# Altium schematic sheet 22 MXM_VIDEO_OUT.SchDoc
size 420 x 297 mm
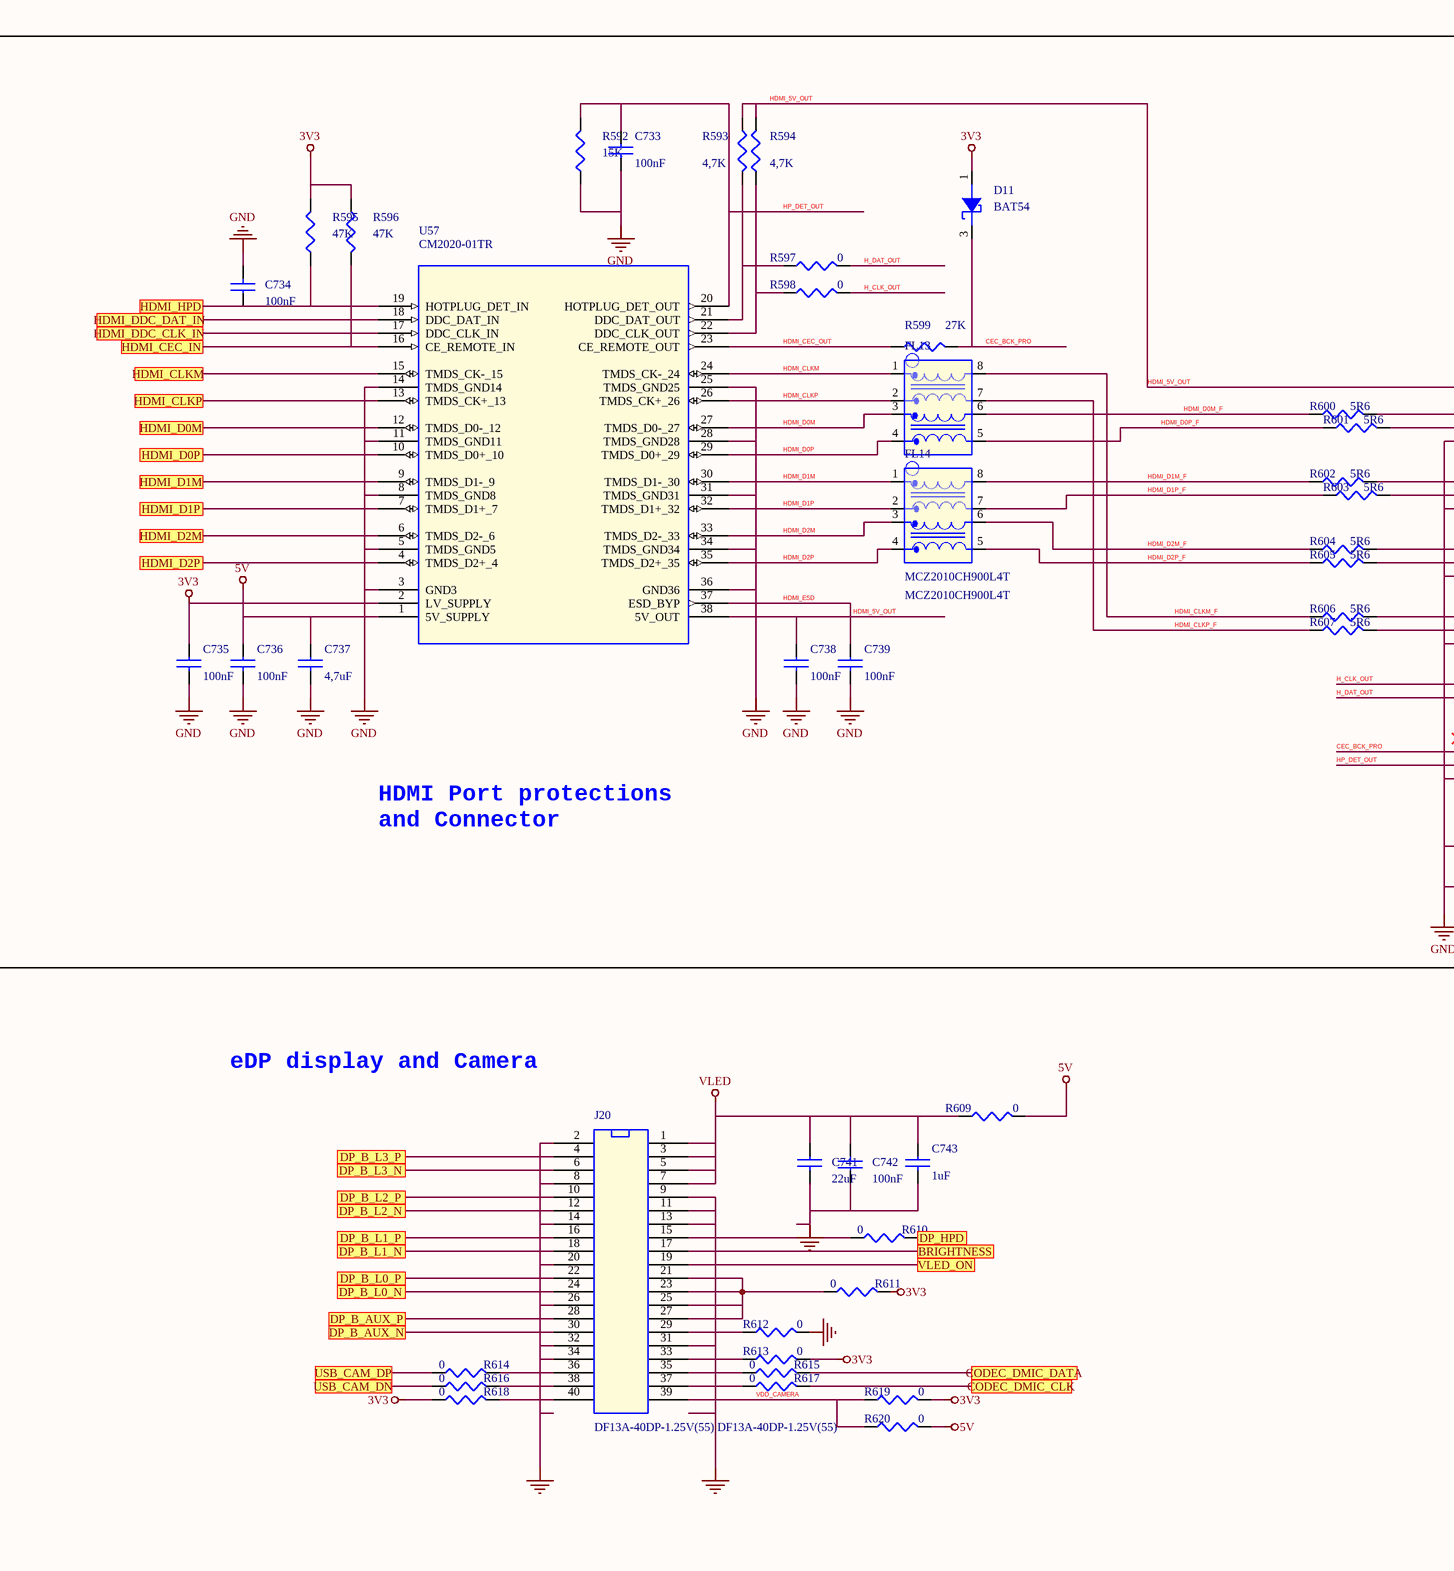
[diagram p0: 22 MXM_VIDEO_OUT.SchDoc, left]
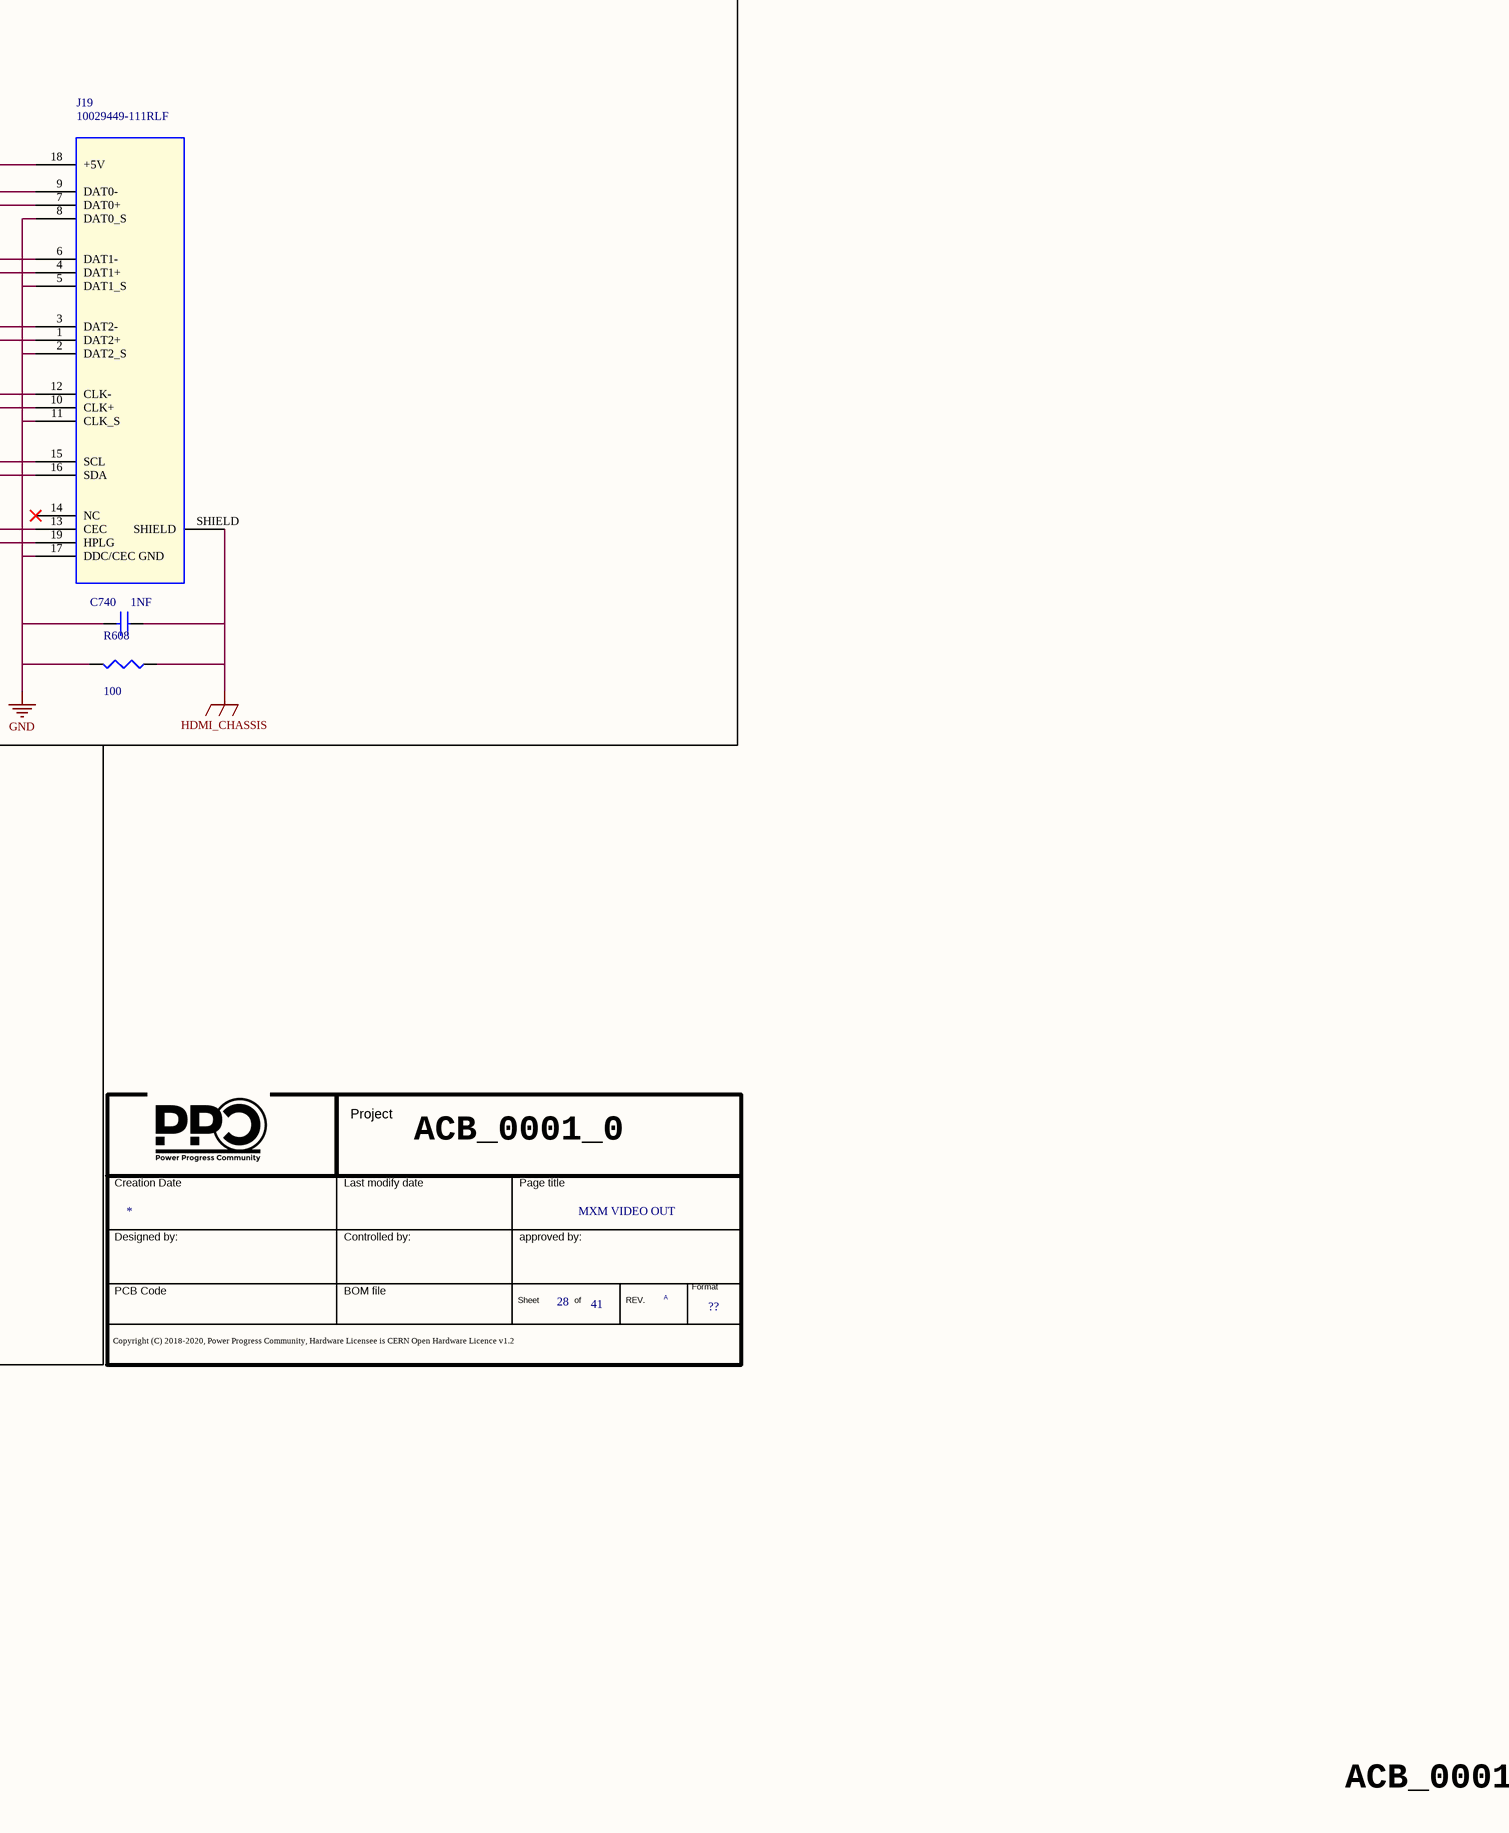
[diagram p1: 22 MXM_VIDEO_OUT.SchDoc, right]

## Parts
*  Doc: MXM VIDEO OUT  Page Count: 41  Page Number: 28  Page Size: ??  RevCode: A  (hidden comment: Title_block_PPC)  (graphical)
C733  100nF  [SMD_0402]
C734  100nF  [SMD_0402]
C735  100nF  [SMD_0402]
C736  100nF  [SMD_0402]
C737  4,7uF  [SMD_0603]
C738  100nF  [SMD_0402]
C739  100nF  [SMD_0402]
C740  1NF  [SMD_1808]
C741  22uF  [SMD_0805]
C742  100nF  [SMD_0402]
C743  1uF  [SMD_0402]
D11  BAT54  [SOT-23]
FL13  MCZ2010CH900L4T  [SMD]
FL14  MCZ2010CH900L4T  [SMD]
J19  10029449-111RLF  [19 PIN SMD]
J20  DF13A-40DP-1.25V(55) / DF13A-40DP-1.25V(55)  [SMD_2X50_P=0.635mm]
R592  15K  [SMD_0402]
R593  4,7K  [SMD_0402]
R594  4,7K  [SMD_0402]
R595  47K  [SMD_0402]
R596  47K  [SMD_0402]
R597  0  [SMD_0402]
R598  0  [SMD_0402]
R599  27K  [SMD_0402]
R600  5R6  [SMD_0402]
R601  5R6  [SMD_0402]
R602  5R6  [SMD_0402]
R603  5R6  [SMD_0402]
R604  5R6  [SMD_0402]
R605  5R6  [SMD_0402]
R606  5R6  [SMD_0402]
R607  5R6  [SMD_0402]
R608  100  [SMD_0402]
R609  0  [SMD_1206]
R610  0  [SMD_0402]
R611  0  [SMD_0402]
R612  0  [SMD_0402]
R613  0  [SMD_0402]
R614  0  [SMD_0402]
R615  0  [SMD_0402]
R616  0  [SMD_0402]
R617  0  [SMD_0402]
R618  0  [SMD_0402]
R619  0  [SMD_0402]
R620  0  [SMD_0402]
U57  CM2020-01TR  [tssop38]

## Blocks framed on the sheet
eDP display and Camera: C741-C743 J20 R609-R620

## Ports
BRIGHTNESS, CODEC_DMIC_CLK, CODEC_DMIC_DATA, DP_B_AUX_N, DP_B_AUX_P, DP_B_L0_N, DP_B_L0_P, DP_B_L1_N, DP_B_L1_P, DP_B_L2_N, DP_B_L2_P, DP_B_L3_N, DP_B_L3_P, DP_HPD, HDMI_CEC_IN, HDMI_CLKM, HDMI_CLKP, HDMI_D0M, HDMI_D0P, HDMI_D1M, HDMI_D1P, HDMI_D2M, HDMI_D2P, HDMI_DDC_CLK_IN, HDMI_DDC_DAT_IN, HDMI_HPD, USB_CAM_DN, USB_CAM_DP, VLED_ON

## Nets
3V3: C735.1 D11.1(ANODE) R595.1 R596.1 R611.1 R613.2 R618.2 R619.2 U57.2(LV_SUPPLY)
5V: C736.1 C737.1 R609.2 R620.2 U57.1(5V_SUPPLY)
GND: C733.2 C734.2 C735.2 C736.2 C737.2 C738.2 C739.2 C740.2 C741.2 C742.1 C743.2 J19.2(DAT2_S) J19.5(DAT1_S) J19.8(DAT0_S) J19.11(CLK_S) J19.17(DDC/CEC_GND) J20.2 J20.8 J20.9 J20.11 J20.13 J20.14 J20.20 J20.26 J20.31 J20.32 J20.34 R592.2 R608.2 R612.2 U57.3(GND3) U57.5(TMDS_GND5) U57.8(TMDS_GND8) U57.11(TMDS_GND11) U57.14(TMDS_GND14) U57.25(TMDS_GND25) U57.28(TMDS_GND28) U57.31(TMDS_GND31) U57.34(TMDS_GND34) U57.36(GND36)
HDMI_CHASSIS: C740.1 J19.SHIELD R608.1
VLED: C741.1 C742.2 C743.1 J20.1 J20.3 J20.5 J20.7 R609.1
BRIGHTNESS: J20.17 ; port BRIGHTNESS
CEC_BCK_PRO: D11.3(CATHODE) J19.13(CEC) R599.2
CODEC_DMIC_CLK: R617.1 ; port CODEC_DMIC_CLK
CODEC_DMIC_DATA: R615.1 ; port CODEC_DMIC_DATA
DP_B_AUX_N: J20.30 ; port DP_B_AUX_N
DP_B_AUX_P: J20.28 ; port DP_B_AUX_P
DP_B_L0_N: J20.24 ; port DP_B_L0_N
DP_B_L0_P: J20.22 ; port DP_B_L0_P
DP_B_L1_N: J20.18 ; port DP_B_L1_N
DP_B_L1_P: J20.16 ; port DP_B_L1_P
DP_B_L2_N: J20.12 ; port DP_B_L2_N
DP_B_L2_P: J20.10 ; port DP_B_L2_P
DP_B_L3_N: J20.6 ; port DP_B_L3_N
DP_B_L3_P: J20.4 ; port DP_B_L3_P
DP_HPD: R610.1 ; port DP_HPD
H_CLK_OUT: J19.15(SCL) R598.2
H_DAT_OUT: J19.16(SDA) R597.2
HDMI_5V_OUT: C738.1 J19.18(+5V) R593.2 R594.2 U57.38(5V_OUT)
HDMI_CEC_IN: R596.2 U57.16(CE_REMOTE_IN) ; port HDMI_CEC_IN
HDMI_CEC_OUT: R599.1 U57.23(CE_REMOTE_OUT)
HDMI_CLKM: FL13.1 U57.24(TMDS_CK-_24)
HDMI_CLKM: U57.15(TMDS_CK-_15) ; port HDMI_CLKM  [a separate net that carries the same name]
HDMI_CLKM_F: FL13.8 R606.1
HDMI_CLKP: FL13.2 U57.26(TMDS_CK+_26)
HDMI_CLKP: U57.13(TMDS_CK+_13) ; port HDMI_CLKP  [a separate net that carries the same name]
HDMI_CLKP_F: FL13.7 R607.1
HDMI_D0M: FL13.3 U57.27(TMDS_D0-_27)
HDMI_D0M: U57.12(TMDS_D0-_12) ; port HDMI_D0M  [a separate net that carries the same name]
HDMI_D0M_F: FL13.6 R600.1
HDMI_D0P: FL13.4 U57.29(TMDS_D0+_29)
HDMI_D0P: U57.10(TMDS_D0+_10) ; port HDMI_D0P  [a separate net that carries the same name]
HDMI_D0P_F: FL13.5 R601.1
HDMI_D1M: FL14.1 U57.30(TMDS_D1-_30)
HDMI_D1M: U57.9(TMDS_D1-_9) ; port HDMI_D1M  [a separate net that carries the same name]
HDMI_D1M_F: FL14.8 R602.1
HDMI_D1P: FL14.2 U57.32(TMDS_D1+_32)
HDMI_D1P: U57.7(TMDS_D1+_7) ; port HDMI_D1P  [a separate net that carries the same name]
HDMI_D1P_F: FL14.7 R603.1
HDMI_D2M: FL14.3 U57.33(TMDS_D2-_33)
HDMI_D2M: U57.6(TMDS_D2-_6) ; port HDMI_D2M  [a separate net that carries the same name]
HDMI_D2M_F: FL14.6 R604.1
HDMI_D2P: FL14.4 U57.35(TMDS_D2+_35)
HDMI_D2P: U57.4(TMDS_D2+_4) ; port HDMI_D2P  [a separate net that carries the same name]
HDMI_D2P_F: FL14.5 R605.1
HDMI_DDC_CLK_IN: U57.17(DDC_CLK_IN) ; port HDMI_DDC_CLK_IN
HDMI_DDC_DAT_IN: U57.18(DDC_DAT_IN) ; port HDMI_DDC_DAT_IN
HDMI_ESD: C739.1 U57.37(ESD_BYP)
HDMI_HPD: C734.1 R595.2 U57.19(HOTPLUG_DET_IN) ; port HDMI_HPD
HP_DET_OUT: C733.1 J19.19(HPLG) R592.1 U57.20(HOTPLUG_DET_OUT)
USB_CAM_DN: R616.2 ; port USB_CAM_DN
USB_CAM_DP: R614.2 ; port USB_CAM_DP
VDD_CAMERA: J20.39 R619.1 R620.1
VLED_ON: J20.19 ; port VLED_ON
NetJ19_1: J19.1(DAT2+) R605.2
NetJ19_3: J19.3(DAT2-) R604.2
NetJ19_4: J19.4(DAT1+) R603.2
NetJ19_6: J19.6(DAT1-) R602.2
NetJ19_7: J19.7(DAT0+) R601.2
NetJ19_9: J19.9(DAT0-) R600.2
NetJ19_10: J19.10(CLK+) R607.2
NetJ19_12: J19.12(CLK-) R606.2
NetJ20_15: J20.15 R610.2
NetJ20_21: J20.21 J20.23 J20.25 J20.27 R611.2
NetJ20_29: J20.29 R612.1
NetJ20_33: J20.33 R613.1
NetJ20_35: J20.35 R615.2
NetJ20_36: J20.36 R614.1
NetJ20_37: J20.37 R617.2
NetJ20_38: J20.38 R616.1
NetJ20_40: J20.40 R618.1
NetR593_1: R593.1 R597.1 U57.21(DDC_DAT_OUT)
NetR594_1: R594.1 R598.1 U57.22(DDC_CLK_OUT)

Not connected (* = marked no-connect by the designer): J19 14(NC)*

## Notes on the sheet
- HDMI Port protections
  and Connector
- ACB_0001_0
- (in symbol Title_block_PPC) Project; Creation Date; Last modify date; Page title; Designed by:; Controlled by:; approved by:; Format; PCB Code; BOM file; Sheet; of; REV.; Copyright (C) 2018-2020, Power Progress Community, Hardware Licensee is CERN Open Hardware Licence v1.2

## Library data of the parts
* = Title_block_PPC: Title: T2080PCIe; Schematic Page Count: 45; Schematic Page Number: 31; Author: MICETEK; Page Create Date: March  8, 1995; Page Title: ?; Page Modify Date: *
C733-C735 C739 = CAP NP_Dup5: COND.CER. 100NF 50V 0402 X7R SMD; Part Number: PASSIVE_24; Manufacturer 1: TDK; Manufacturer Part Number 1: CGA2B3X7R1H104M050BD; TECNO77: C0402; RSM: RC0402; Part Type: Capacitors\Ceramic\SMD\0402; Distributor 1: MURATA ELETTRONICA SPA; PCB Footprint: SMD_0402
C736 C738 = CAP NP_Dup5: COND.CER. 100NF 50V 0402 X7R SMD; Manufacturer Part Number 1: CGA2B3X7R1H104M050BD; Manufacturer 1: TDK; Part Number: PASSIVE_24; TECNO77: C0402; RSM: RC0402; Distributor 1: MURATA ELETTRONICA SPA; Part Type: Capacitors\Ceramic\SMD\0402; PCB Footprint: SMD_0402
C737 = CAP NP_Dup5: COND.CER.4,7uF 16V X5R 0603 SMD; Part Number: PASSIVE_1405; Manufacturer 1: SAMSUNG; Manufacturer Part Number 1: CL10A475KO8NNNC; TECNO77: C0603; RSM: RC0603; Part Type: Capacitors\Ceramic\SMD\0603; Distributor 1: DIGIKEY (490-3302-1-ND); PCB Footprint: SMD_0603
C740 = CAP NP_Dup5: CAP CER 1000PF 2KV 20% X7R 1808; Manufacturer Part Number 1: 1808GC102MAT1A; Manufacturer 1: AVX; Part Number: PASSIVE_280; RSM: RC1808; TECNO77: C1210; PCB Footprint: SMD_1808; Distributor 1: DIGIKEY(709-1040-1-ND); Part Type: Capacitors\Ceramic\SMD\1808
C741 = CAP NP_Dup2: 22UF 35V 20% 0805; Manufacturer Part Number 1: C2012X5R1V226M125AC; Manufacturer 1: TDK; Part Number: PASSIVE_224; RSM: RC0805; PCB Footprint: SMD_0805; Part Type: Capacitors\Ceramic\SMD\0805
C742 = CAP NP_Dup9: COND.CER. 100NF 50V 0402 X7R SMD; Manufacturer Part Number 1: CGA2B3X7R1H104M050BD; Manufacturer 1: TDK; Part Number: PASSIVE_24; RSM: RC0402; Distributor 1: MURATA ELETTRONICA SPA; Part Type: Capacitors\Ceramic\SMD\0402; PCB Footprint: SMD_0402
C743 = CAP NP_Dup9: CAP CER 1UF 6.3V 10% X5R 0402 AUTOMOTIVE; Part Number: PASSIVE_49; Manufacturer 1: Taiyo Yuden; Manufacturer Part Number 1: JMK105BJ105KVHF; RSM: RC0402; Part Type: Capacitors\Ceramic\SMD\0402; Distributor 1: DIGIKEY (587-3766-1-ND); PCB Footprint: SMD_0402
D11 = diode_schottky_SOT23_Dup1: DIODE SCHOTTKY 30V 200MA SOT-23; Part Number: DISCRETE_84; Manufacturer 1: ZETEX; TECNO77: SOT23_P321; Part Type: Diodes\SCHOTTKY; Manufacturer Part Number 1: BAT54; Distributor 1: FARNELL (1467516); PCB Footprint: SOT-23; RSM: SOT-23
FL13 FL14 = CHOKE_HS_DUAL: CHOKE COMM MODE 90 OHM SMD HDMI; Part Number: PASSIVE_353; Manufacturer 1: TDK; RSM: EMI-MCZ2010CH; Part Type: Inductors\SMD\CM Choke; Manufacturer Part Number 1: MCZ2010CH900L4T; PCB Footprint: SMD
J19 = CONN_HDMI_0: HDMI TYPE A RECEPT RA SMD; Part Number: CONNECTORS_561; Manufacturer 1: FCI; TECNO77: CN-HDMI-FCI-10029449-001RLF; RSM: FCI-HDMI-10029449-111RLF; PCB Footprint: 19 PIN SMD; Part Type: VPORT\HDMI; Manufacturer Part Number 1: 10029449-111RLF; Distributor 1: MOUSER (649-10029449-111RLF)
J20 = HEADER_20X2: Terminali e capicorda 1.25MM V PIN HEADER 40P SMT; PART NUMBER: CONNECTORS_135; Manufacturer 1: HIROSE; RSM: HIROSE-DF13A-40DP-1_25; PCB Footprint: SMD 2X20 P_125MM; Part Type: DF13; Manufacturer Part Number 1: DF13A-40DP-1.25V(55) / DF13A-40DP-1.25V(55); Distributor 1: DIGIKEY(H10166-ND)
R592 = R_Dup5: RESIS.CHIP 15K 1% 0402 SMD; Manufacturer 1: ROYAL OHM; Part Number: PASSIVE_614; RSM: RC0402; Manufacturer Part Number 1: RESIS.CHIP 15K 1% 0402 SMD; PCB Footprint: SMD_0402; Part Type: Resistors\Fixed\SMD\0402\1%
R593 R594 = R_Dup7: RESIS.CHIP 4,7K 5% 0402 SMD; Manufacturer 1: ROYAL OHM; Part Number: PASSIVE_861; TECNO77: R0402; RSM: RC0402; Distributor 1: CAMEL ELETTRONICA SRL  #; Manufacturer Part Number 1: RESIS.CHIP 4,7K 5% 0402 SMD; Part Type: Resistors\Fixed\SMD\0402\5%; PCB Footprint: SMD_0402
R595 R596 = R_Dup5: RESIS.CHIP 47K 1% 0402 SMD; Part Number: PASSIVE_737; Manufacturer 1: ROYAL OHM; RSM: RC0402; Part Type: Resistors\Fixed\SMD\0402\1%; PCB Footprint: SMD_0402; Manufacturer Part Number 1: RESIS.CHIP 47K 1% 0402 SMD
R597 R598 = R_Dup7: RESIS.CHIP 0R 5% 0402 SMD; Manufacturer 1: ROYAL OHM; Part Number: PASSIVE_805; TECNO77: R0402; RSM: RC0402; Distributor 1: CAMEL ELETTRONICA SRL  #; Manufacturer Part Number 1: RESIS.CHIP 0R 5% 0402 SMD; Part Type: Resistors\Fixed\SMD\0402\5%; PCB Footprint: SMD_0402
R599 = R_Dup7: RESIS.CHIP 27K 1% 0402 SMD; Manufacturer 1: ROYAL OHM; Part Number: PASSIVE_664; RSM: RC0402; TECNO77: R0402; Distributor 1: CAMEL ELETTRONICA SRL  #; Manufacturer Part Number 1: RESIS.CHIP 27K 1% 0402 SMD; Part Type: Resistors\Fixed\SMD\0402\1%; PCB Footprint: SMD_0402
R600 R601 R605 = R_Dup5: RESIS.CHIP 5.6 ohm 5% 0402 SMD; Part Number: PASSIVE_1423; Manufacturer 1: YAGEO; Manufacturer Part Number 1: RC0402JR-075R6L; RSM: RC0402; Part Type: Resistors\Fixed\SMD\0402\5%; Distributor 1: DIGIKEY(311-5.6JRDKR-ND); PCB Footprint: SMD_0402
R602-R604 R606 R607 = R_Dup5: RESIS.CHIP 5.6 ohm 5% 0402 SMD; Manufacturer Part Number 1: RC0402JR-075R6L; Manufacturer 1: YAGEO; Part Number: PASSIVE_1423; RSM: RC0402; Distributor 1: DIGIKEY(311-5.6JRDKR-ND); Part Type: Resistors\Fixed\SMD\0402\5%; PCB Footprint: SMD_0402
R608 = R_Dup5: RESIS.CHIP 100R 5% 0402 SMD; Manufacturer 1: ROYAL OHM; Part Number: PASSIVE_812; RSM: RC0402; Manufacturer Part Number 1: RESIS.CHIP 100R 5% 0402 SMD; PCB Footprint: SMD_0402; Part Type: Resistors\Fixed\SMD\0402\5%
R609 = R_Dup5: RESIS. 0R 1/4W 1206 SMD E96; Part Number: PASSIVE_1266; Manufacturer 1: ASJ; Manufacturer Part Number 1: CR32000ZL; RSM: RC1206; Part Type: Resistors\Fixed\SMD\1206\5%; Distributor 1: TTI ITALY SRL; PCB Footprint: SMD_1206
R610 = R_Dup5: RESIS.CHIP 0R 5% 0402 SMD; Manufacturer 1: ROYAL OHM; Part Number: PASSIVE_805; RSM: RC1206; Distributor 1: CAMEL ELETTRONICA SRL  #; Manufacturer Part Number 1: RESIS.CHIP 0R 5% 0402 SMD; Part Type: Resistors\Fixed\SMD\0402\5%; PCB Footprint: SMD_0402
R611 R614-R617 R620 = R_Dup5: RESIS.CHIP 0R 5% 0402 SMD; Manufacturer 1: ROYAL OHM; Part Number: PASSIVE_805; RSM: RC0402; Distributor 1: CAMEL ELETTRONICA SRL  #; Manufacturer Part Number 1: RESIS.CHIP 0R 5% 0402 SMD; Part Type: Resistors\Fixed\SMD\0402\5%; PCB Footprint: SMD_0402
R612 R613 R618 R619 = R_Dup5: RESIS.CHIP 0R 5% 0402 SMD; Part Number: PASSIVE_805; Manufacturer 1: ROYAL OHM; RSM: RC0402; Part Type: Resistors\Fixed\SMD\0402\5%; Manufacturer Part Number 1: RESIS.CHIP 0R 5% 0402 SMD; Distributor 1: CAMEL ELETTRONICA SRL  #; PCB Footprint: SMD_0402
U57 = CM2020_TSSOP_38P: IC XMTR HDMI ESD PROTECTION 5V TSSOP38; Part Number: LOGIC_105; Manufacturer 1: ON Semi; RSM: TSSOP-38; TECNO77: TSSOP38P0.5; CAD_APPROVED: Yes; MFG_NAME01: ON SEMICONDUCTOR; AGILE_PN: 312-80388; CLASS: IC; Part Type: HDMI\TRANSMITTER; Distributor 1: DIGIKEY(CM2020-01TROSCT-ND); Manufacturer Part Number 1: CM2020-01TR; HEIGHT: 1.2MM; ROHS: Yes; MFG_PN01: CM2020-01TR; PCB Footprint: tssop38